# Altium project kont_lineP-C.PrjPcb
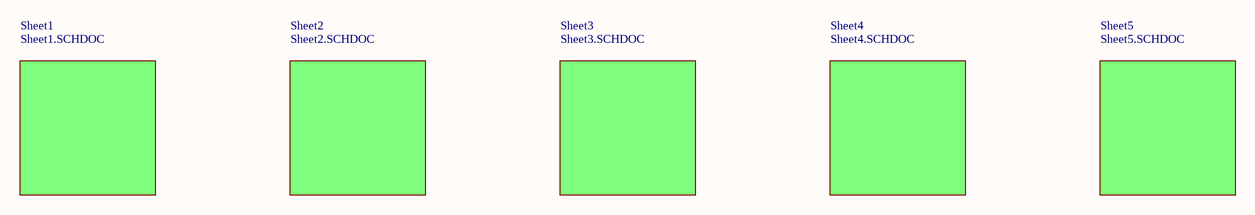
[diagram p0: First_Sheet.SCHDOC]
6 sheets, 211 parts. Net scope: global (net labels, ports and power ports of the same name join across sheets).
Sheets:
  First_Sheet.SCHDOC
    Sheet1 = Sheet1.SCHDOC
    Sheet2 = Sheet2.SCHDOC
    Sheet3 = Sheet3.SCHDOC
    Sheet4 = Sheet4.SCHDOC
    Sheet5 = Sheet5.SCHDOC

## Sheet First_Sheet.SCHDOC
size 840 x 594 mm

### Sub-sheets
Sheet1 = Sheet1.SCHDOC: no entries
Sheet2 = Sheet2.SCHDOC: no entries
Sheet3 = Sheet3.SCHDOC: no entries
Sheet4 = Sheet4.SCHDOC: no entries
Sheet5 = Sheet5.SCHDOC: no entries

## Sheet Sheet1.SCHDOC
size 840 x 594 mm; SheetNumber: 1; SheetTotal: 5; DocumentName: Sheet1.SCHDOC
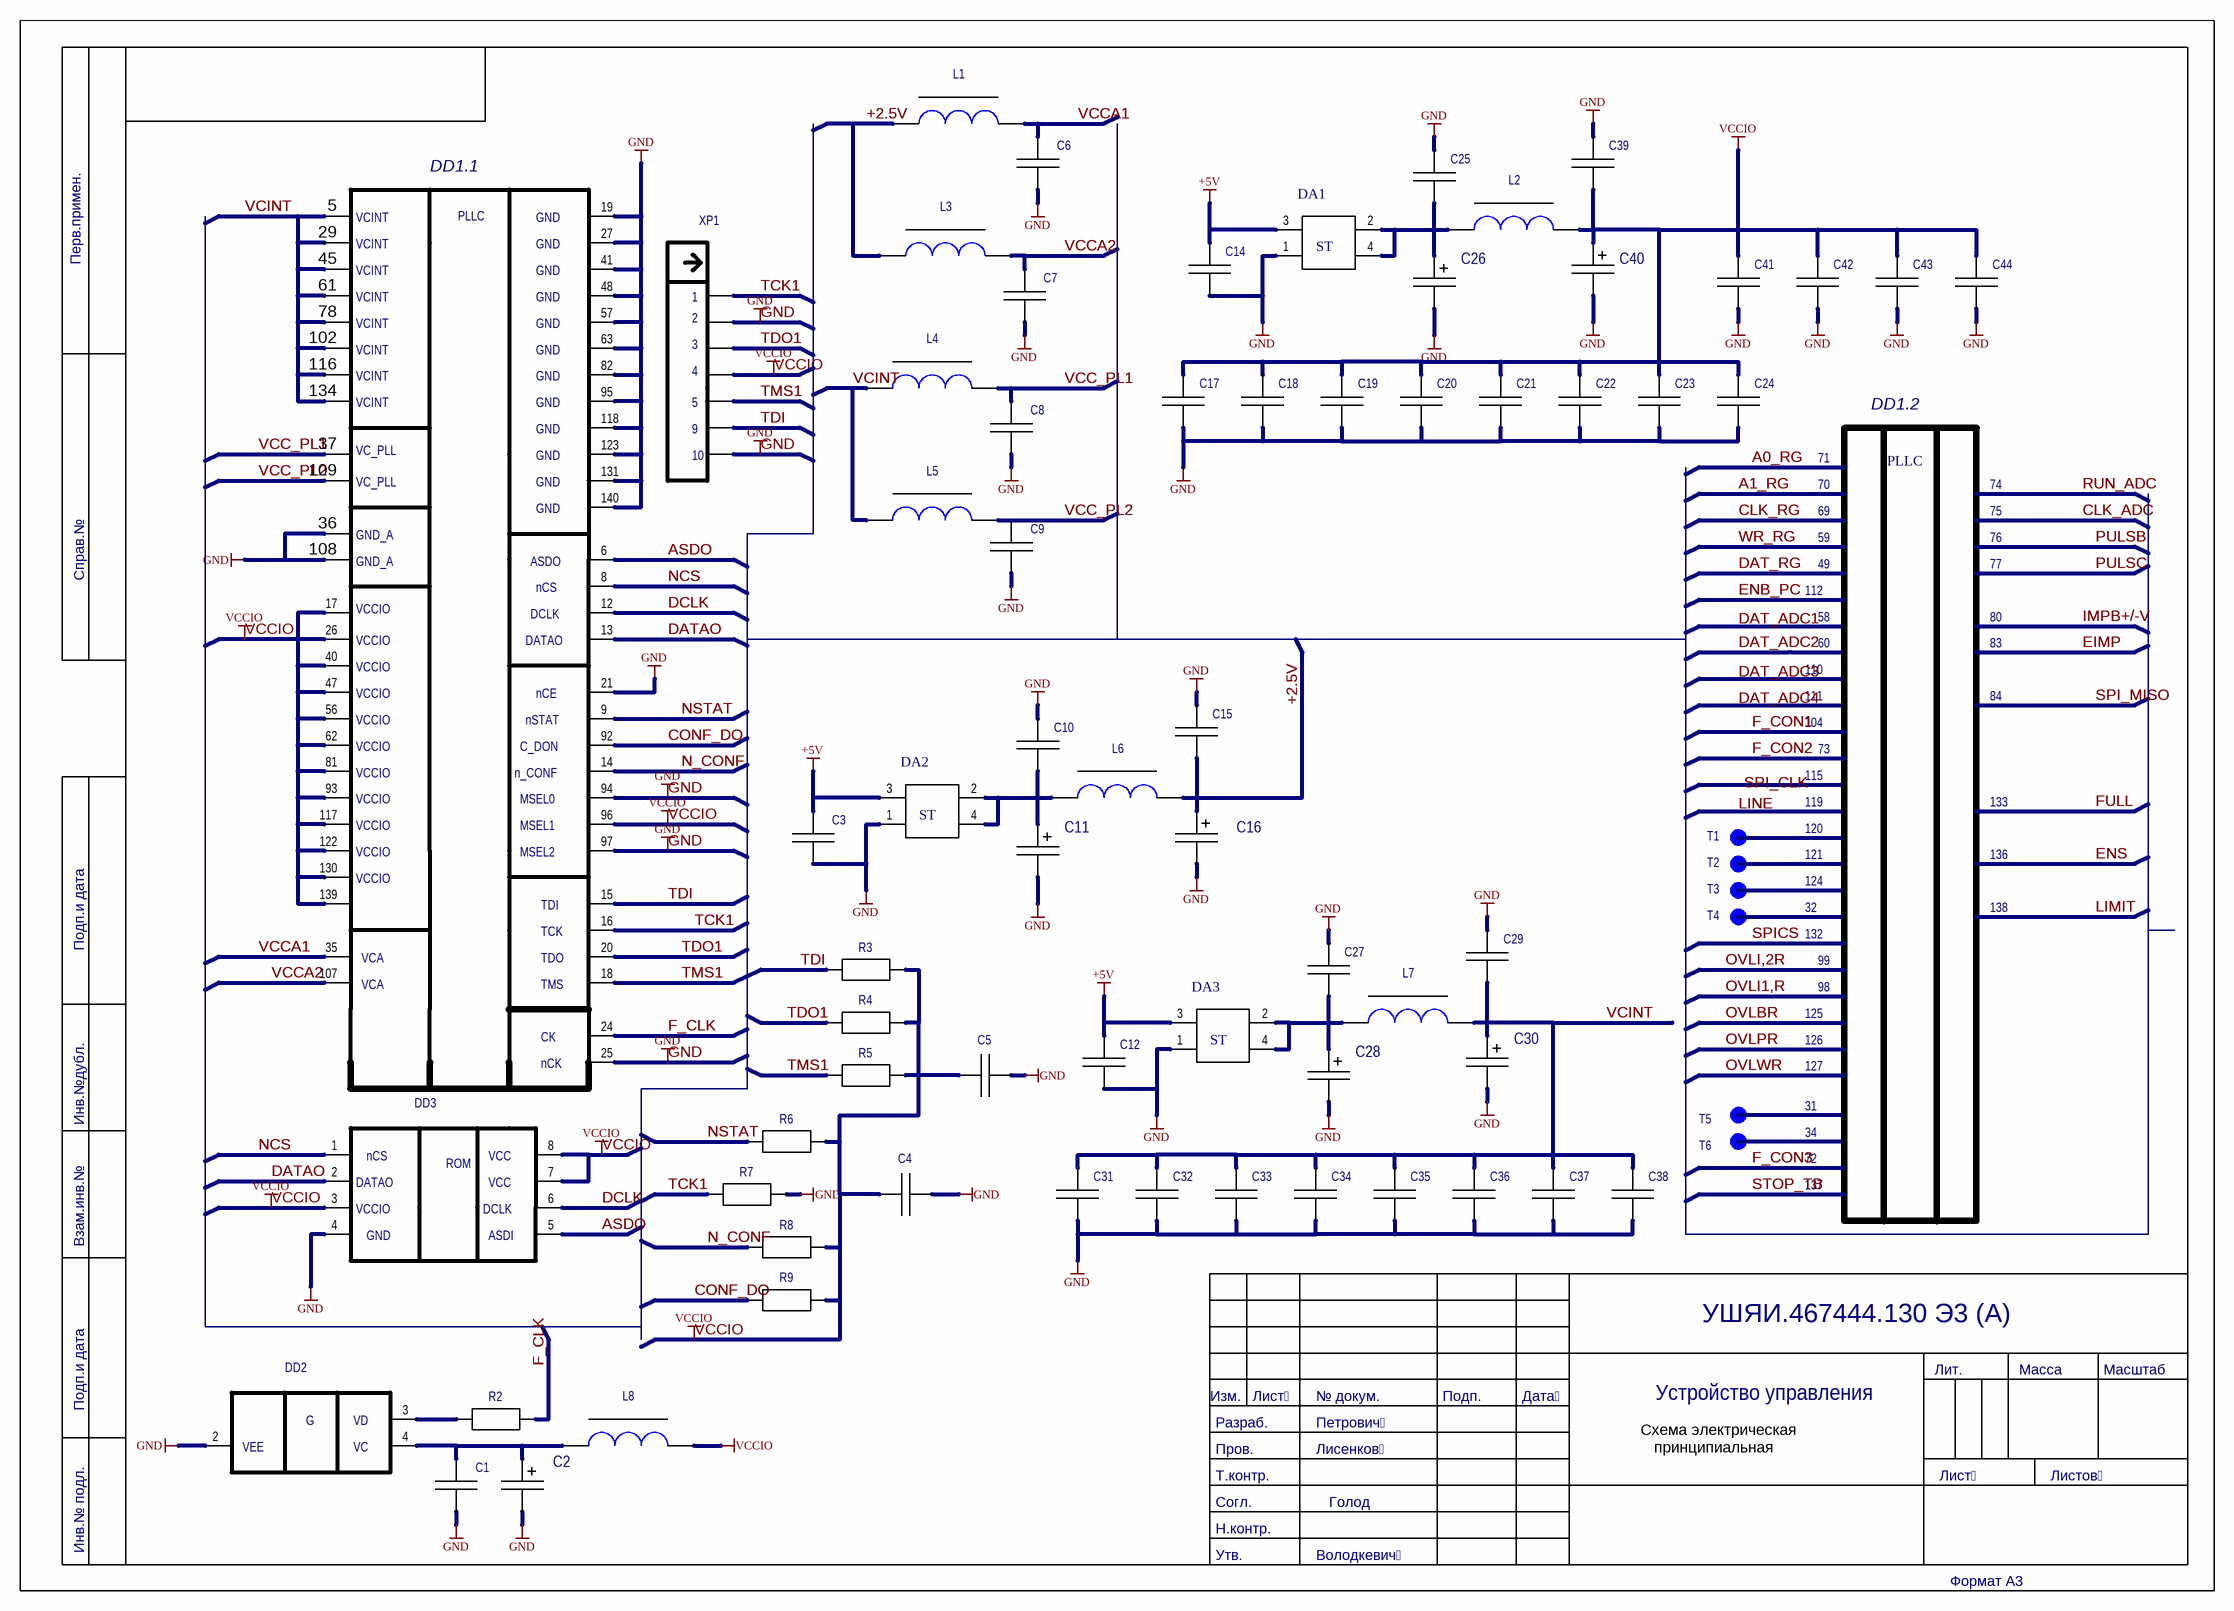
[diagram p1: Sheet1.SCHDOC]

### Parts
C1  GRM21BR71H104KA01L  (value not drawn)
C2  TAJB475K020  (value not drawn)
C3  GRM21BR71H104KA01L  (value not drawn)
C4  GRM21BR71H104KA01L  (value not drawn)
C5  GRM21BR71H104KA01L  (value not drawn)
C6  GRM21BR71H104KA01L  (value not drawn)
C7  GRM21BR71H104KA01L  (value not drawn)
C8  GRM21BR71H104KA01L  (value not drawn)
C9  GRM21BR71H104KA01L  (value not drawn)
C10  GRM21BR71H104KA01L  (value not drawn)
C11  TAJB475K020  (value not drawn)
C12  GRM21BR71H104KA01L  (value not drawn)
C14  GRM21BR71H104KA01L  (value not drawn)
C15  GRM21BR71H104KA01L  (value not drawn)
C16  TAJB106M016  (value not drawn)
C17  GRM21BR71H104KA01L  (value not drawn)
C18  GRM21BR71H104KA01L  (value not drawn)
C19  GRM21BR71H104KA01L  (value not drawn)
C20  GRM21BR71H104KA01L  (value not drawn)
C21  GRM21BR71H104KA01L  (value not drawn)
C22  GRM21BR71H104KA01L  (value not drawn)
C23  GRM21BR71H104KA01L  (value not drawn)
C24  GRM21BR71H104KA01L  (value not drawn)
C25  GRM21BR71H104KA01L  (value not drawn)
C26  TAJB475K020  (value not drawn)
C27  GRM21BR71H104KA01L  (value not drawn)
C28  TAJB475K020  (value not drawn)
C29  GRM21BR71H104KA01L  (value not drawn)
C30  TAJB106M016  (value not drawn)
C31  GRM21BR71H104KA01L  (value not drawn)
C32  GRM21BR71H104KA01L  (value not drawn)
C33  GRM21BR71H104KA01L  (value not drawn)
C34  GRM21BR71H104KA01L  (value not drawn)
C35  GRM21BR71H104KA01L  (value not drawn)
C36  GRM21BR71H104KA01L  (value not drawn)
C37  GRM21BR71H104KA01L  (value not drawn)
C38  GRM21BR71H104KA01L  (value not drawn)
C39  GRM21BR71H104KA01L  (value not drawn)
C40  TAJB106M016  (value not drawn)
C41  GRM21BR71H104KA01L  (value not drawn)
C42  GRM21BR71H104KA01L  (value not drawn)
C43  GRM21BR71H104KA01L  (value not drawn)
C44  GRM21BR71H104KA01L  (value not drawn)
DA1  LD1117AS33TR  (value not drawn)
DA2  LD1117AS25TR  (value not drawn)
DA3  LD1117AS12TR  (value not drawn)
DD1.1  EP3C5E144I7-G  (value not drawn)
DD2  J032  (value not drawn)
DD3  EPCS4SI8N  (value not drawn)
L1  LQH31CNR22M03  (value not drawn)
L2  ILBB0805ER601V  (value not drawn)
L3  LQH31CNR22M03  (value not drawn)
L4  LQH31CNR22M03  (value not drawn)
L5  LQH31CNR22M03  (value not drawn)
L6  ILBB0805ER601V  (value not drawn)
L7  ILBB0805ER601V  (value not drawn)
L8  ILBB0805ER601V  (value not drawn)
R2  0805-51 ОМ+-5%  [0805]  (value not drawn)
R3  0805-1 KОМ+-5%  [0805]  (value not drawn)
R4  0805-10 KОМ+-5%  [0805]  (value not drawn)
R5  0805-1 KОМ+-5%  [0805]  (value not drawn)
R6  0805-10 KОМ+-5%  [0805]  (value not drawn)
R7  0805-1 KОМ+-5%  [0805]  (value not drawn)
R8  0805-10 KОМ+-5%  [0805]  (value not drawn)
R9  0805-10 KОМ+-5%  [0805]  (value not drawn)
T1  ТОЧКА ПАЙКИ 1  [LEPESTOK7_750_224]  (value not drawn)
T13  ТОЧКА ПАЙКИ 1  [LEPESTOK7_750_224]  (value not drawn)
T14  ТОЧКА ПАЙКИ 1  [LEPESTOK7_750_224]  (value not drawn)
T15  ТОЧКА ПАЙКИ 1  [LEPESTOK7_750_224]  (value not drawn)
T20  ТОЧКА ПАЙКИ 1  [LEPESTOK7_750_224]  (value not drawn)
T21  ТОЧКА ПАЙКИ 1  [LEPESTOK7_750_224]  (value not drawn)
XP1  PLD-10  (value not drawn)

### Nets
+5V: C3.2 C12.2 C14.2 DA1.3 DA2.3 DA3.3
GND: C1.1 C2.2 C3.1 C4.2 C5.2 C6.1 C7.1 C8.1 C9.1 C10.2 C11.2 C12.1 C14.1 C15.2 C16.2 C17.1 C18.1 C19.1 C20.1 C21.1 C22.1 C23.1 C24.1 C25.2 C26.2 C27.2 C28.2 C29.2 C30.2 C31.1 C32.1 C33.1 C34.1 C35.1 C36.1 C37.1 C38.1 C39.2 C40.2 C41.1 C42.1 C43.1 C44.1 DA1.1 DA2.1 DA3.1 DD1.1.19 DD1.1.21 DD1.1.25 DD1.1.27 DD1.1.36 DD1.1.41 DD1.1.48 DD1.1.57 DD1.1.63 DD1.1.82 DD1.1.94 DD1.1.95 DD1.1.97 DD1.1.108 DD1.1.118 DD1.1.123 DD1.1.131 DD1.1.140 DD2.2 DD3.4 R7.2 XP1.2 XP1.10
VCCIO: C4.1 C5.1 C17.2 C18.2 C19.2 C20.2 C21.2 C22.2 C23.2 C24.2 C39.1 C40.1 C41.2 C42.2 C43.2 C44.2 DD1.1.17 DD1.1.26 DD1.1.40 DD1.1.47 DD1.1.56 DD1.1.62 DD1.1.81 DD1.1.93 DD1.1.96 DD1.1.117 DD1.1.122 DD1.1.130 DD1.1.139 DD3.3 DD3.7 DD3.8 L2.2 L8.2 R3.2 R4.2 R5.2 R6.2 R8.2 R9.2 XP1.4
+2.5V: C15.1 C16.1 L1.1 L3.1 L6.2
ASDO: DD1.1.6 DD3.5
CONF_DO: DD1.1.92 R9.1
DATAO: DD1.1.13 DD3.2
DCLK: DD1.1.12 DD3.6
F_CLK: DD1.1.24 R2.2
N_CONF: DD1.1.14 R8.1
NCS: DD1.1.8 DD3.1
NSTAT: DD1.1.9 R6.1
TCK1: DD1.1.16 R7.1 XP1.1
TDI: DD1.1.15 R3.1 XP1.9
TDO1: DD1.1.20 R4.1 XP1.3
TMS1: DD1.1.18 R5.1 XP1.5
VCC_PL1: C8.2 DD1.1.37 L4.2
VCC_PL2: C9.2 DD1.1.109 L5.2
VCCA1: C6.2 DD1.1.35 L1.2
VCCA2: C7.2 DD1.1.107 L3.2
VCINT: C29.1 C30.1 C31.2 C32.2 C33.2 C34.2 C35.2 C36.2 C37.2 C38.2 DD1.1.5 DD1.1.29 DD1.1.45 DD1.1.61 DD1.1.78 DD1.1.102 DD1.1.116 DD1.1.134 L4.1 L5.1 L7.2
NetC1_2: C1.2 C2.1 DD2.4 L8.1
NetC10_1: C10.1 C11.1
NetC25_1: C25.1 C26.1 DA1.2 DA1.4 L2.1
NetC27_1: C27.1 C28.1
NetDA2_2: DA2.2 DA2.4 L6.1
NetDA3_2: DA3.2 DA3.4 L7.1
NetDD2_3: DD2.3 R2.1

Not connected (* = marked no-connect by the designer): T1 1; T13 1; T14 1; T15 1; T20 1; T21 1

### Notes on the sheet
- (near DD1.1) DD1.1
- Перв.примен.
- DD1.2
- 70
- 71
- PLLC
- 74
- 69
- 49
- 59
- 75
- 76
- 77
- Справ.№
- 112
- 58
- 80
- 110
- 111
- 60
- 84
- 83
- 104
- 73
- 120
- 115
- 119
- 133
- T1
- T2
- T3
- 121
- 124
- 136
- Подп.и дата
- T4
- 32
- 132
- 99
- 138
- 125
- 98
- 126
- 127
- Инв.№дубл.
- T5
- T6
- 72
- 34
- 31
- Взам.инв.№
- 137
- УШЯИ.467444.130 Э3 (A)
- Лит.
- Масса
- Масштаб
- Изм.
- Разраб.
- Лист
- № докум.
- Петрович
- Подп.
- Дата
- Устройство управления
- Т.контр.
- Согл.
- Пров.
- Лисенков
- Голод
- Схема электрическая
  принципиальная
- Листов
- Инв.№ подл.
- Утв.
- Н.контр.
- Володкевич
- Формат А3
- Подп. дата
- Инв. № дубл.
- Взам. инв. №
- Подп. и дата
- Инв. № подл.
- Лист
- Дата
- ALTIUM GOSTBOM2.0 KEV
- Файл:
- Копировал
- (in symbol EP3C5E144I7-G) PLLC; VCINT; GND; VC_PLL; GND_A; ASDO; nCS; VCCIO; DCLK; DATAO; nCE; nSTAT; C_DON; n_CONF; MSEL0; MSEL1; MSEL2; TDI; TCK; VCA; TDO; TMS; CK; nCK
- (in symbol EPCS4SI8N) ROM; nCS; VCC; DATAO; VCCIO; DCLK; GND; ASDI
- (in symbol J032) G; VD; VEE; VC
- (in symbol LD1117AS12TR) ST
- (in symbol LD1117AS25TR) ST
- (in symbol LD1117AS33TR) ST

### Library data of the parts
C1 C3-C10 C12 C14 C15 C17-C25 C27 C29 C31-C39 C41-C44 = GRM21BR71H104KA01L: Name2: Конденсатор GRM21BR71H104KA01L; Value: *; Name1: Конденсатор GRM21BR71H104KA01L
C2 C11 C26 C28 = TAJB475K020: Standart: AVX; Name2: Конденсатор  TAJB475K020; Name1: Конденсатор TAJB475K020; Value: *
C16 C30 C40 = TAJB106M016: Standart: AVX; Name2: Конденсатор  TAJB106M016; Name1: Конденсатор TAJB106M016; Value: *
L1 L3-L5 = LQH31CNR22M03: Standart: MURATA; Name2: Дроссель LQH31CNR22M03; Name1: Дроссель LQH31CNR22M03
L2 L6-L8 = ILBB0805ER601V: Standart: MURATA; Name2: Дроссель ILBB0805ER601V; Name1: Дроссель ILBB0805ER601V
R2 = 0805-51 ОМ+-5%: Value: 51 Ом; Name1: Резистор 0805-51 Ом +-5%; Name2: Резистор 0805-51 Ом +-5%
R3 R5 R7 = 0805-1 KОМ+-5%: Value: 1 кОм; Name1: Резистор 0805-1 кОм+-5%; Name2: Резистор 0805-1 кОм+-5%
R4 R6 R8 R9 = 0805-10 KОМ+-5%: Name1: Резистор 0805-10 кОм+-5%; Name2: Резистор 0805-10 кОм+-5%
T1 T13-T15 T20 T21 = ТОЧКА ПАЙКИ 1: Name: Точка пайки; Value: *
DA1 = LD1117AS33TR: Value: *
DA2 = LD1117AS25TR: Value: *
DA3 = LD1117AS12TR: Value: *
DD1.1 = EP3C5E144I7-G: Value: *
DD2 = J032: Value: *
DD3 = EPCS4SI8N: Value: *
XP1 = PLD-10: Value: *

## Sheet Sheet2.SCHDOC
size 840 x 594 mm; SheetNumber: 2; SheetTotal: 5; DocumentName: Sheet2.SCHDOC
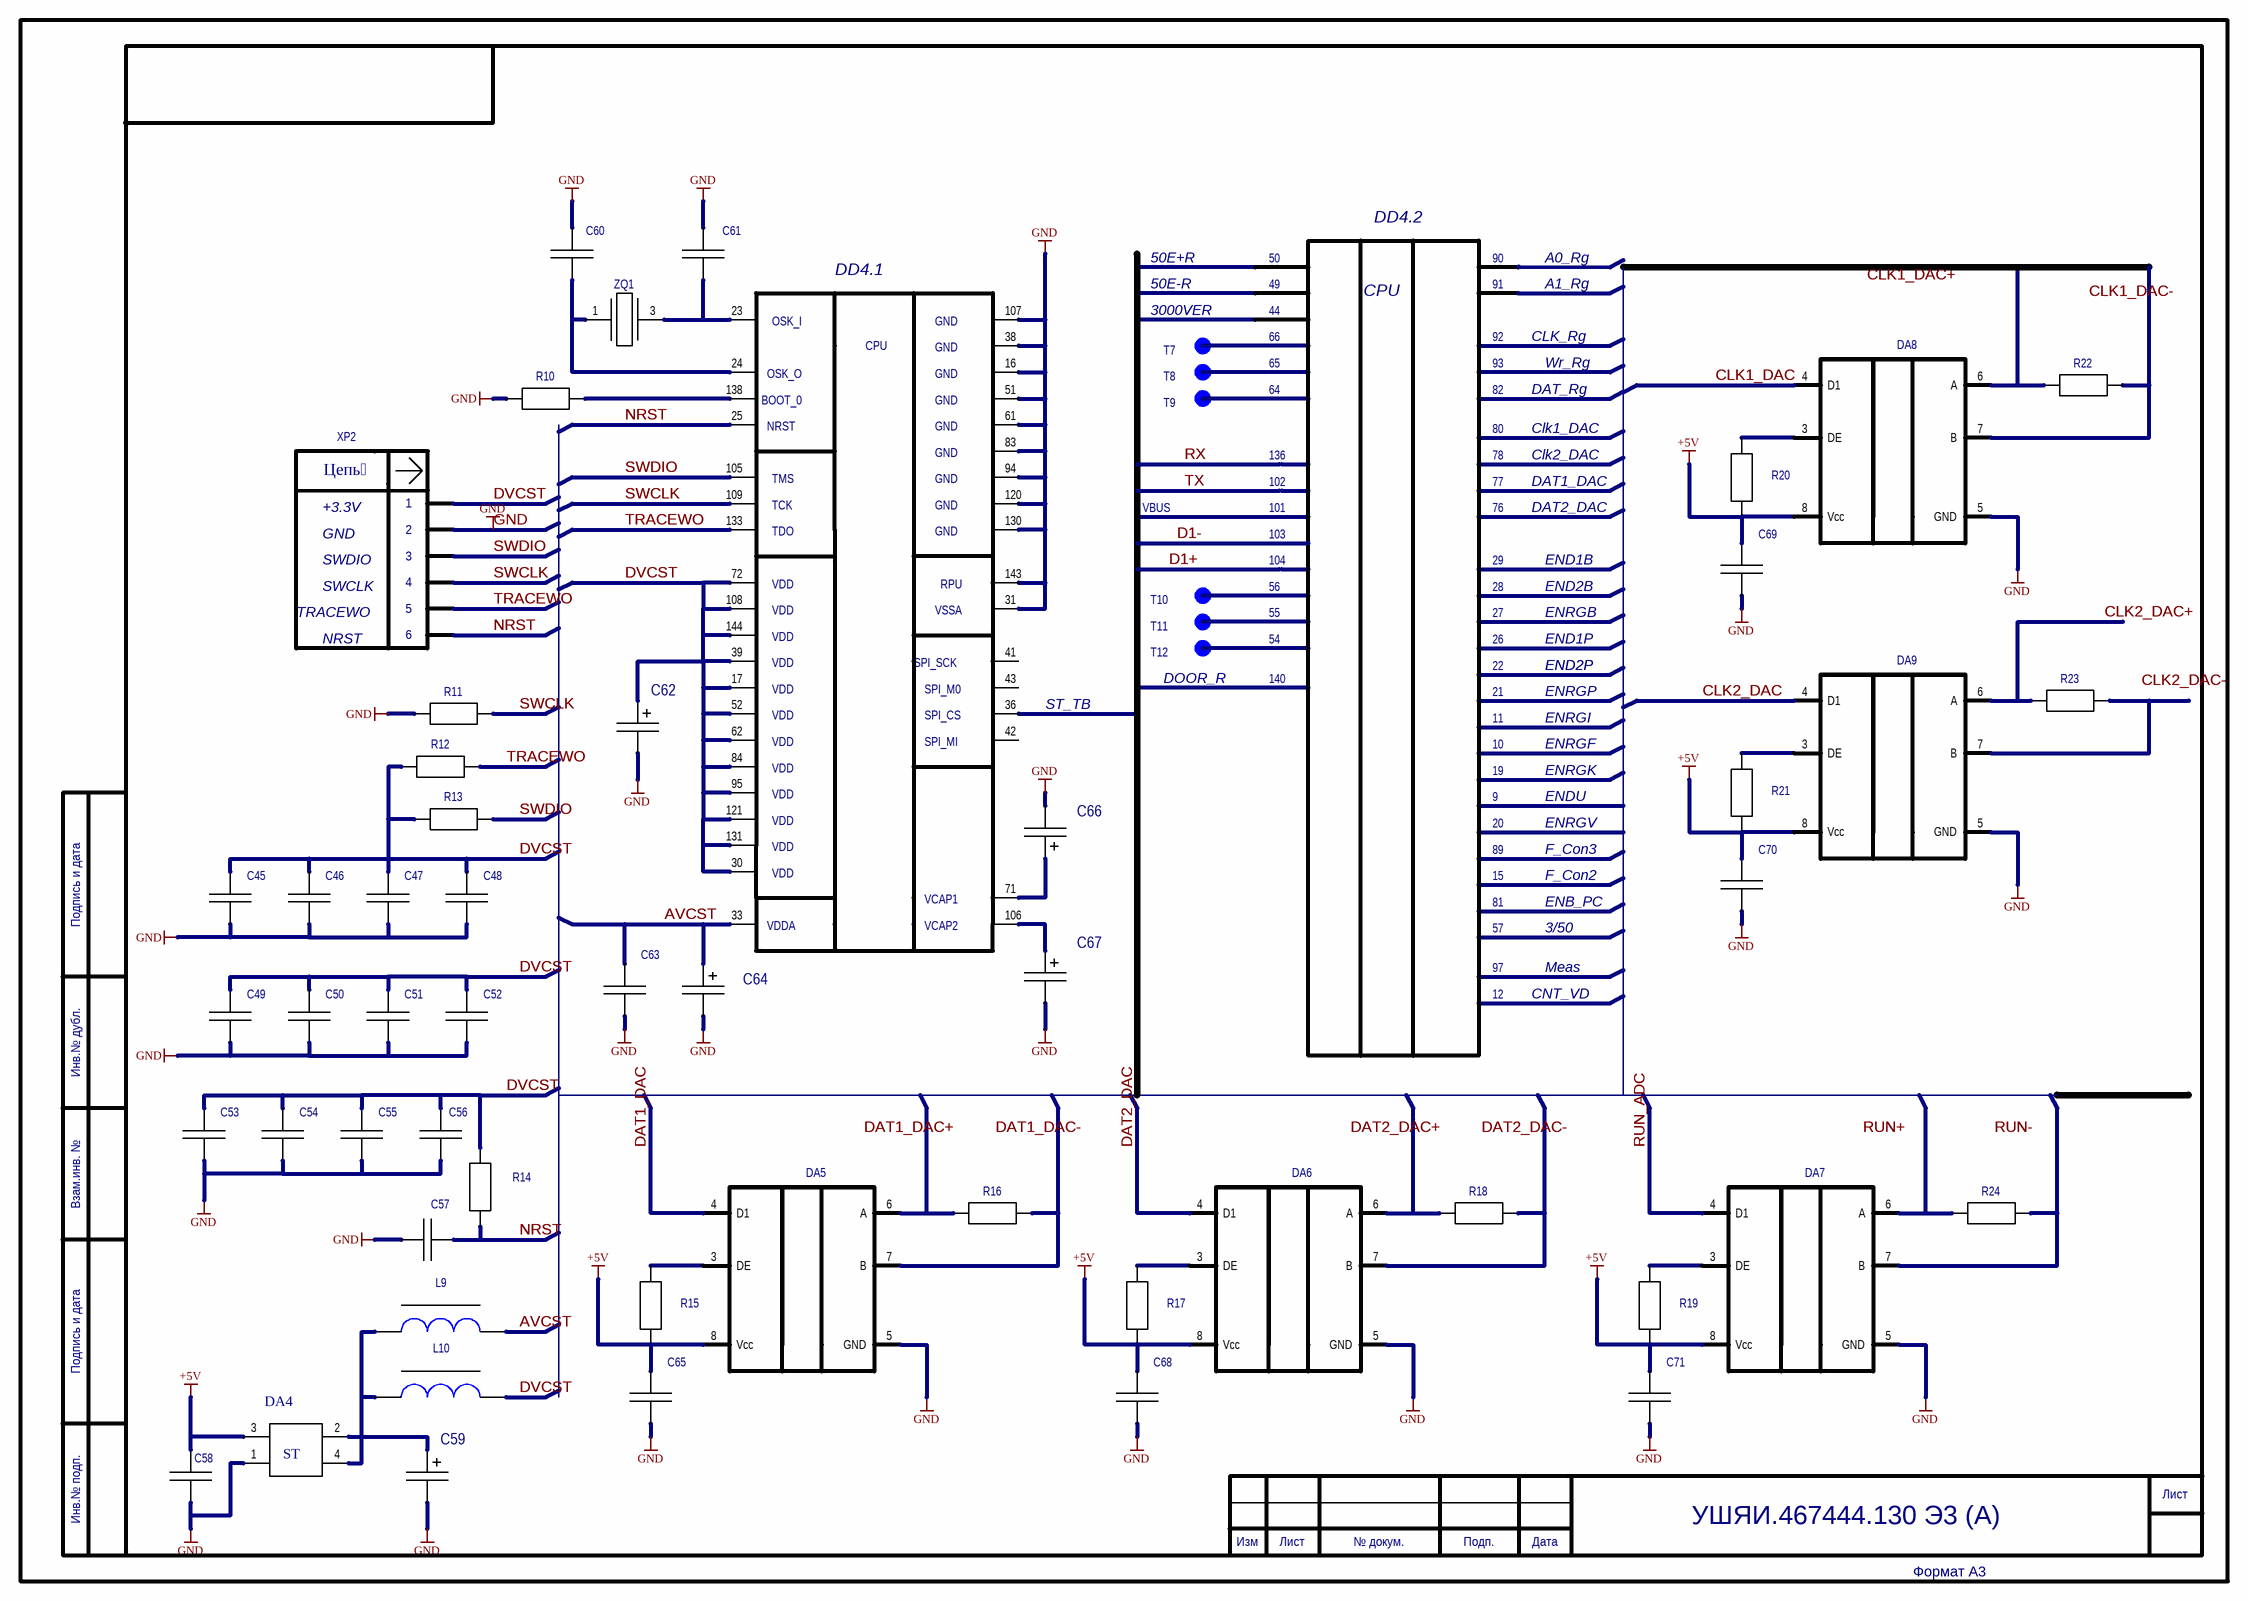
[diagram p2: Sheet2.SCHDOC]

### Parts
C45  GRM21BR71H104KA01L  (value not drawn)
C46  GRM21BR71H104KA01L  (value not drawn)
C47  GRM21BR71H104KA01L  (value not drawn)
C48  GRM21BR71H104KA01L  (value not drawn)
C49  GRM21BR71H104KA01L  (value not drawn)
C50  GRM21BR71H104KA01L  (value not drawn)
C51  GRM21BR71H104KA01L  (value not drawn)
C52  GRM21BR71H104KA01L  (value not drawn)
C53  GRM21BR71H104KA01L  (value not drawn)
C54  GRM21BR71H104KA01L  (value not drawn)
C55  GRM21BR71H104KA01L  (value not drawn)
C56  GRM21BR71H104KA01L  (value not drawn)
C57  GRM21BR71H104KA01L  (value not drawn)
C58  GRM21BR71H104KA01L  (value not drawn)
C59  TAJB475K020  (value not drawn)
C60  805-CG-20 ПФ  (value not drawn)
C61  805-CG-20 ПФ  (value not drawn)
C62  TAJB106M016  (value not drawn)
C63  GRM21BR71H104KA01L  (value not drawn)
C64  TAJB106M016  (value not drawn)
C65  GRM21BR71H104KA01L  (value not drawn)
C66  TAJA225M016  (value not drawn)
C67  TAJA225M016  (value not drawn)
C68  GRM21BR71H104KA01L  (value not drawn)
C69  GRM21BR71H104KA01L  (value not drawn)
C70  GRM21BR71H104KA01L  (value not drawn)
C71  GRM21BR71H104KA01L  (value not drawn)
DA4  LD1117AS33TR  (value not drawn)
DA5  ADM483  (value not drawn)
DA6  ADM483  (value not drawn)
DA7  ADM483  (value not drawn)
DA8  ADM483  (value not drawn)
DA9  ADM483  (value not drawn)
DD4.2  STM32F407ZGTX-A  (value not drawn)
L9  ILBB0805ER601V  (value not drawn)
L10  ILBB0805ER601V  (value not drawn)
R10  0805-10 KОМ+-5%  [0805]  (value not drawn)
R11  0805-10 KОМ+-5%  [0805]  (value not drawn)
R12  0805-10 KОМ+-5%  [0805]  (value not drawn)
R13  0805-10 KОМ+-5%  [0805]  (value not drawn)
R14  0805-10 KОМ+-5%  [0805]  (value not drawn)
R15  0805-10 KОМ+-5%  [0805]  (value not drawn)
R16  0805-10 KОМ+-5%  [0805]  (value not drawn)
R17  0805-10 KОМ+-5%  [0805]  (value not drawn)
R18  0805-10 KОМ+-5%  [0805]  (value not drawn)
R19  0805-10 KОМ+-5%  [0805]  (value not drawn)
R20  0805-10 KОМ+-5%  [0805]  (value not drawn)
R21  0805-10 KОМ+-5%  [0805]  (value not drawn)
R22  0805-10 KОМ+-5%  [0805]  (value not drawn)
R23  0805-10 KОМ+-5%  [0805]  (value not drawn)
R24  0805-10 KОМ+-5%  [0805]  (value not drawn)
T16  ТОЧКА ПАЙКИ 1  [LEPESTOK7_750_224]  (value not drawn)
T17  ТОЧКА ПАЙКИ 1  [LEPESTOK7_750_224]  (value not drawn)
T18  ТОЧКА ПАЙКИ 1  [LEPESTOK7_750_224]  (value not drawn)
T19  ТОЧКА ПАЙКИ 1  [LEPESTOK7_750_224]  (value not drawn)
T22  ТОЧКА ПАЙКИ 1  [LEPESTOK7_750_224]  (value not drawn)
T23  ТОЧКА ПАЙКИ 1  [LEPESTOK7_750_224]  (value not drawn)
XP2  AMP II 280372-2  (value not drawn)
ZQ1  QUARZ JXS63  [JXS63]  (value not drawn)

### Nets
+5V: C58.2 C65.2 C68.2 C69.2 C70.2 C71.2 DA4.3 DA5.8(Vcc) DA6.8(Vcc) DA7.8(Vcc) DA8.8(Vcc) DA9.8(Vcc) R15.1 R17.1 R19.1 R20.1 R21.1
GND: C45.1 C46.1 C47.1 C48.1 C49.1 C50.1 C51.1 C52.1 C53.1 C54.1 C55.1 C56.1 C57.2 C58.1 C59.2 C60.2 C61.2 C62.2 C63.1 C64.2 C65.1 C66.2 C67.2 C68.1 C69.1 C70.1 C71.1 DA4.1 DA5.5(GND) DA6.5(GND) DA7.5(GND) DA8.5(GND) DA9.5(GND) DD4.2.16 DD4.2.31 DD4.2.38 DD4.2.51 DD4.2.61 DD4.2.83 DD4.2.94 DD4.2.107 DD4.2.120 DD4.2.130 DD4.2.143 R10.1 R11.1 XP2.2
AVCST: C63.2 C64.1 DD4.2.33 L9.2
CLK1_DAC: DA8.4(D1)
CLK2_DAC: DA9.4(D1)
CLK2_DAC+: DA9.6(A) R23.1
DAT1_DAC: DA5.4(D1)
DAT2_DAC: DA6.4(D1)
DVCST: C45.2 C46.2 C47.2 C48.2 C49.2 C50.2 C51.2 C52.2 C53.2 C54.2 C55.2 C56.2 C62.1 DD4.2.17 DD4.2.30 DD4.2.39 DD4.2.52 DD4.2.62 DD4.2.72 DD4.2.84 DD4.2.95 DD4.2.108 DD4.2.121 DD4.2.131 DD4.2.144 L10.2 R12.1 R13.1 R14.2 XP2.1
NRST: C57.1 DD4.2.25 R14.1 XP2.6
RUN_ADC: DA7.4(D1)
SWCLK: DD4.2.109 R11.2 XP2.4
SWDIO: DD4.2.105 R13.2 XP2.3
TRACEWO: DD4.2.133 R12.2 XP2.5
NetC59_1: C59.1 DA4.2 DA4.4 L9.1 L10.1
NetC60_1: C60.1 DD4.2.24 ZQ1.1
NetC61_1: C61.1 DD4.2.23 ZQ1.3
NetC66_1: C66.1 DD4.2.71
NetC67_1: C67.1 DD4.2.106
NetDA5_3: DA5.3(DE) R15.2
NetDA5_6: DA5.6(A) R16.1
NetDA5_7: DA5.7(B) R16.2
NetDA6_3: DA6.3(DE) R17.2
NetDA6_6: DA6.6(A) R18.1
NetDA6_7: DA6.7(B) R18.2
NetDA7_3: DA7.3(DE) R19.2
NetDA7_6: DA7.6(A) R24.1
NetDA7_7: DA7.7(B) R24.2
NetDA8_3: DA8.3(DE) R20.2
NetDA8_6: DA8.6(A) R22.1
NetDA8_7: DA8.7(B) R22.2
NetDA9_3: DA9.3(DE) R21.2
NetDA9_7: DA9.7(B) R23.2
NetDD4.2_138: DD4.2.138 R10.2

Not connected (* = marked no-connect by the designer): DD4.2 36 41 42 43; T16 1; T17 1; T18 1; T19 1; T22 1; T23 1; ZQ1 2 4

### Notes on the sheet
- DD4.2
- (near DD4.2) DD4.1
- 50E-R
- 50E+R
- 49
- 50
- 90
- 91
- A1_Rg
- A0_Rg
- (near T16) 3000VER
- T7
- 44
- 66
- CPU
- 92
- CLK_Rg
- T9
- T8
- 64
- 65
- 82
- 93
- DAT_Rg
- Wr_Rg
- 102
- 136
- 77
- 80
- 78
- DAT1_DAC
- Clk1_DAC
- Clk2_DAC
- +3.3V
- GND
- VBUS
- 101
- 103
- 76
- DAT2_DAC
- TRACEWO
- SWDIO
- SWCLK
- T10
- 104
- 56
- 55
- 29
- 28
- 27
- END1B
- END2B
- ENRGB
- NRST
- T12
- T11
- (near T23) DOOR_R
- 140
- 54
- 26
- 22
- 21
- END1P
- END2P
- ENRGP
- (near DD4.2) ST_TB
- 11
- 10
- ENRGI
- ENRGF
- 9
- 20
- 19
- ENDU
- ENRGV
- ENRGK
- Подпись и дата
- 15
- 89
- F_Con2
- F_Con3
- 81
- 57
- 3/50
- ENB_PC
- 12
- 97
- CNT_VD
- Meas
- Инв.№ дубл.
- Взам.инв. №
- Инв.№ подп.
- Лист
- Изм
- № докум.
- Подп.
- Дата
- УШЯИ.467444.130 Э3 (A)
- Формат А3
- Подп. дата
- Инв. № дубл.
- Взам. инв. №
- Подп. и дата
- Инв. № подл.
- Изм.
- ALTIUM GOSTBOM2.0 KEV
- Файл:
- Копировал
- (in symbol AMP II 280372-2) Цепь
- (in symbol LD1117AS33TR) ST
- (in symbol STM32F407ZGTX-A) OSK_I; GND; CPU; OSK_O; BOOT_0; NRST; TMS; TCK; TDO; VDD; RPU; VSSA; SPI_SCK; SPI_M0; SPI_CS; SPI_MI; VCAP1; VDDA; VCAP2

### Library data of the parts
C45-C58 C63 C65 C68-C71 = GRM21BR71H104KA01L: Name2: Конденсатор GRM21BR71H104KA01L; Value: *; Name1: Конденсатор GRM21BR71H104KA01L
C59 = TAJB475K020: as C2 on sheet Sheet1; Value: *
C60 C61 = 805-CG-20 ПФ: Name2: Конденсатор 805-CG-20 пФ; Name1: Конденсатор 805-CG-20 пФ
C62 C64 = TAJB106M016: as C16 on sheet Sheet1; Value: *
C66 C67 = TAJA225M016: Standart: AVX; Name2: Конденсатор  TAJA225M016; Name1: Конденсатор TAJA225M016; Value: *
DA5-DA9 = ADM483: Standart: Analog Devices; Name2: ADM483AR; Value: *; Name1: ADM483AR
L9 L10 = ILBB0805ER601V: as L2 on sheet Sheet1; Name1: Дроссель ILBB0805ER601V
R10-R24 = 0805-10 KОМ+-5%: Name1: Резистор 0805-10 кОм+-5%; Name2: Резистор 0805-10 кОм+-5%
T16-T19 T22 T23 = ТОЧКА ПАЙКИ 1: Name: Точка пайки; Value: *
XP2 = AMP II 280372-2: Name2: Вилка AMPMODU II-280379-2 Tyco Electronics; Name1: Вилка AMPMODU II-280379-2  Tyco Electronics; Standart: ELFA (43-836-26); Value: *
ZQ1 = QUARZ JXS63: Standart: Jauch; Name1: Резонатор Q 25.0JXS63-12-30/30-FU Jauch; Name2: Резонатор Q 25.0JXS63-12-30/30-FU; Value: *
DA4 = LD1117AS33TR: Value: *
DD4.2 = STM32F407ZGTX-A: Value: *

## Sheet Sheet3.SCHDOC
size 840 x 594 mm; SheetNumber: 3; SheetTotal: 5; DocumentName: Sheet3.SCHDOC
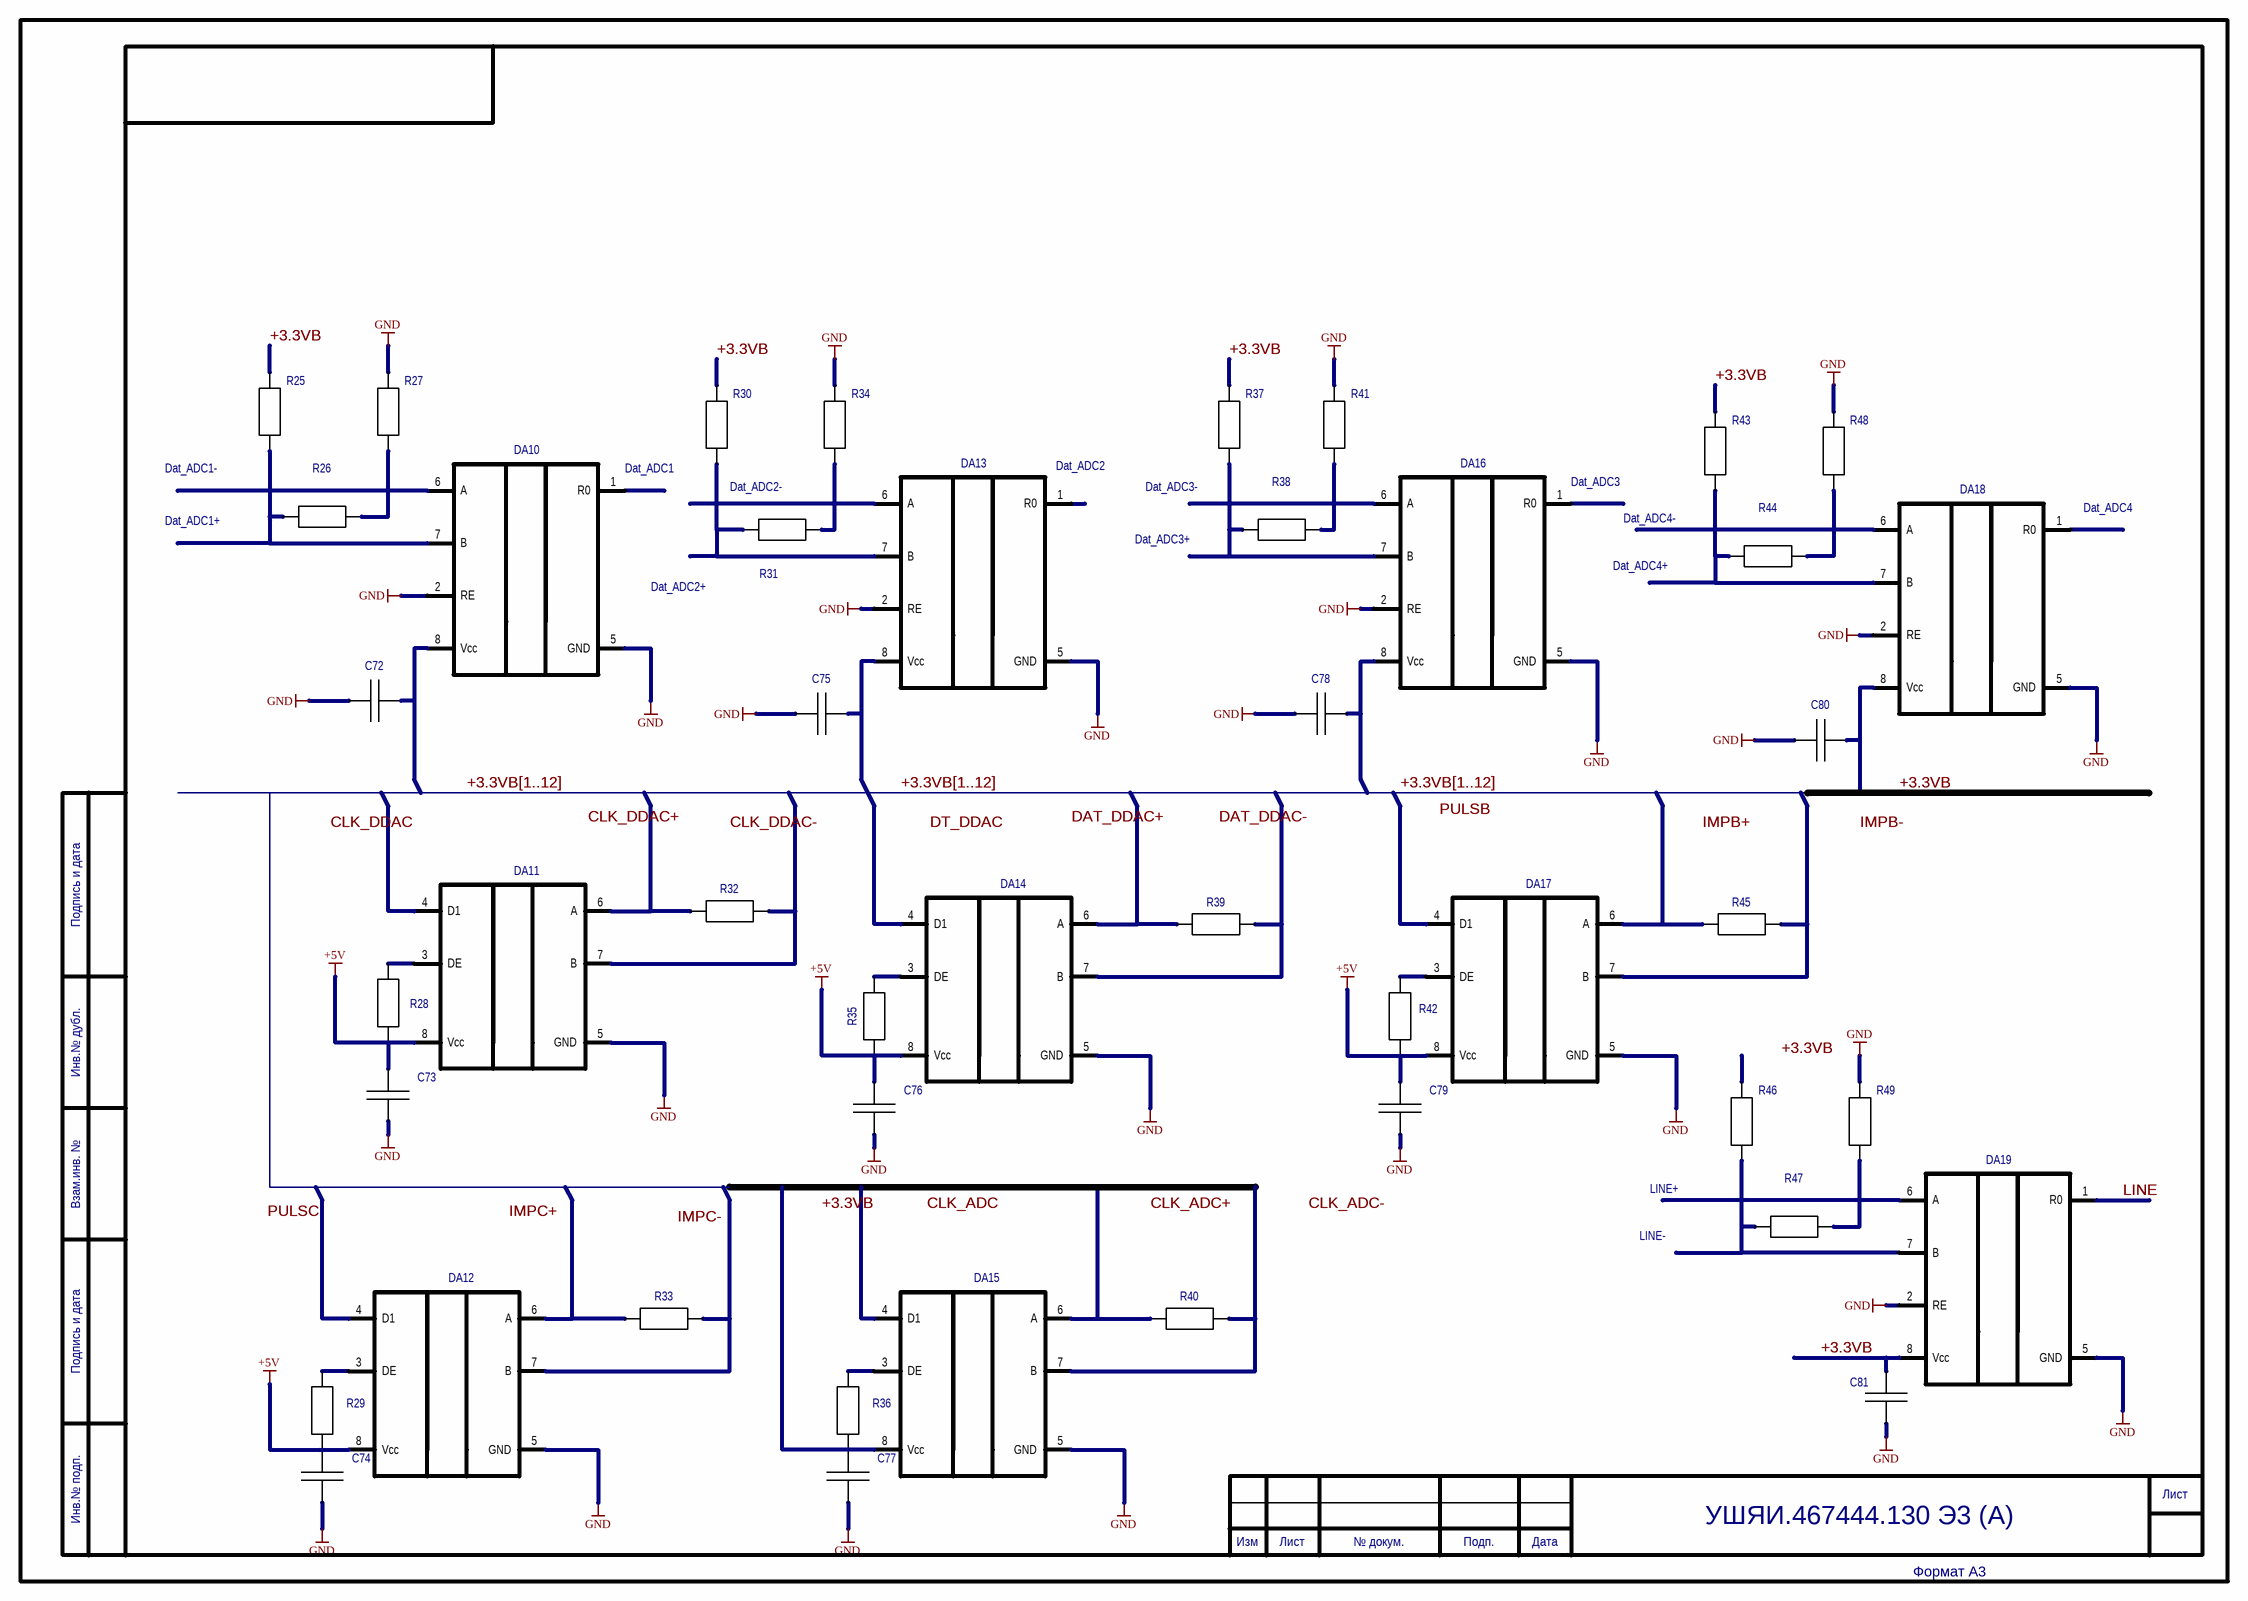
[diagram p3: Sheet3.SCHDOC]

### Parts
C72  GRM21BR71H105K  (value not drawn)
C73  GRM21BR71H104KA01L  (value not drawn)
C74  GRM21BR71H104KA01L  (value not drawn)
C75  GRM21BR71H105K  (value not drawn)
C76  GRM21BR71H104KA01L  (value not drawn)
C77  GRM21BR71H104KA01L  (value not drawn)
C78  GRM21BR71H105K  (value not drawn)
C79  GRM21BR71H104KA01L  (value not drawn)
C80  GRM21BR71H105K  (value not drawn)
C81  GRM21BR71H105K  (value not drawn)
DA10  SN65HVD75  (value not drawn)
DA11  ADM483  (value not drawn)
DA12  ADM483  (value not drawn)
DA13  SN65HVD75  (value not drawn)
DA14  ADM483  (value not drawn)
DA15  SN65HVD75-A  (value not drawn)
DA16  SN65HVD75  (value not drawn)
DA17  ADM483  (value not drawn)
DA18  SN65HVD75  (value not drawn)
DA19  SN65HVD75  (value not drawn)
R25  1206-1 КОМ+-5%  (value not drawn)
R26  1206 - 100 ОМ+-5%  (value not drawn)
R27  1206-1 КОМ+-5%  (value not drawn)
R28  0805-10 KОМ+-5%  [0805]  (value not drawn)
R29  0805-10 KОМ+-5%  [0805]  (value not drawn)
R30  1206-1 КОМ+-5%  (value not drawn)
R31  1206 - 100 ОМ+-5%  (value not drawn)
R32  0805-10 KОМ+-5%  [0805]  (value not drawn)
R33  0805-10 KОМ+-5%  [0805]  (value not drawn)
R34  1206-1 КОМ+-5%  (value not drawn)
R35  0805-10 KОМ+-5%  [0805]  (value not drawn)
R36  0805-10 KОМ+-5%  [0805]  (value not drawn)
R37  1206-1 КОМ+-5%  (value not drawn)
R38  1206 - 100 ОМ+-5%  (value not drawn)
R39  0805-10 KОМ+-5%  [0805]  (value not drawn)
R40  0805-10 KОМ+-5%  [0805]  (value not drawn)
R41  1206-1 КОМ+-5%  (value not drawn)
R42  0805-10 KОМ+-5%  [0805]  (value not drawn)
R43  1206-1 КОМ+-5%  (value not drawn)
R44  1206 - 100 ОМ+-5%  (value not drawn)
R45  0805-10 KОМ+-5%  [0805]  (value not drawn)
R46  1206-1 КОМ+-5%  (value not drawn)
R47  1206 - 100 ОМ+-5%  (value not drawn)
R48  1206-1 КОМ+-5%  (value not drawn)
R49  1206-1 КОМ+-5%  (value not drawn)

### Nets
+5V: C73.2 C74.2 C76.2 C79.2 DA11.8(Vcc) DA12.8(Vcc) DA14.8(Vcc) DA17.8(Vcc) R28.1 R29.1 R35.1 R42.1
GND: C72.1 C73.1 C74.1 C75.1 C76.1 C77.1 C78.1 C79.1 C80.1 C81.1 DA10.2(RE) DA10.5(GND) DA11.5(GND) DA12.5(GND) DA13.2(RE) DA13.5(GND) DA14.5(GND) DA15.5(GND) DA16.2(RE) DA16.5(GND) DA17.5(GND) DA18.2(RE) DA18.5(GND) DA19.2(RE) DA19.5(GND) R27.2 R34.2 R41.2 R48.2 R49.2
+3.3VB: C81.2 DA19.8(Vcc) R25.2 R30.2 R37.2 R43.2
LINE: DA19.1(R0)
NetC72_2: C72.2 DA10.8(Vcc)
NetC75_2: C75.2 DA13.8(Vcc)
NetC77_2: C77.2 DA15.8(Vcc) R36.1
NetC78_2: C78.2 DA16.8(Vcc)
NetC80_2: C80.2 DA18.8(Vcc)
NetDA10_6: DA10.6(A) R26.2 R27.1
NetDA10_7: DA10.7(B) R25.1 R26.1
NetDA11_3: DA11.3(DE) R28.2
NetDA11_6: DA11.6(A) R32.1
NetDA11_7: DA11.7(B) R32.2
NetDA12_3: DA12.3(DE) R29.2
NetDA12_6: DA12.6(A) R33.1
NetDA12_7: DA12.7(B) R33.2
NetDA13_6: DA13.6(A) R31.2 R34.1
NetDA13_7: DA13.7(B) R30.1 R31.1
NetDA14_3: DA14.3(DE) R35.2
NetDA14_6: DA14.6(A) R39.1
NetDA14_7: DA14.7(B) R39.2
NetDA15_3: DA15.3(DE) R36.2
NetDA15_6: DA15.6(A) R40.1
NetDA15_7: DA15.7(B) R40.2
NetDA16_6: DA16.6(A) R38.2 R41.1
NetDA16_7: DA16.7(B) R37.1 R38.1
NetDA17_3: DA17.3(DE) R42.2
NetDA17_6: DA17.6(A) R45.1
NetDA17_7: DA17.7(B) R45.2
NetDA18_6: DA18.6(A) R44.2 R48.1
NetDA18_7: DA18.7(B) R43.1 R44.1
NetDA19_6: DA19.6(A) R47.2 R49.1
NetDA19_7: DA19.7(B) R46.1 R47.1

Not connected (* = marked no-connect by the designer): DA10 1(R0); DA11 4(D1); DA12 4(D1); DA13 1(R0); DA14 4(D1); DA15 4(D1); DA16 1(R0); DA17 4(D1); DA18 1(R0); R46 2

### Buses and harness runs
bus +3.3VB[1..12]

### Notes on the sheet
- (near R25) Dat_ADC1-
- Dat_ADC1
- Dat_ADC2-
- (near DA13) Dat_ADC2
- Dat_ADC3-
- (near DA16) Dat_ADC3
- (near DA18) Dat_ADC4
- Dat_ADC1+
- Dat_ADC3+
- Dat_ADC4+
- Dat_ADC4-
- Dat_ADC2+
- Подпись и дата
- Инв.№ дубл.
- Взам.инв. №
- LINE-
- LINE+
- Инв.№ подп.
- УШЯИ.467444.130 Э3 (A)
- Лист
- Изм
- № докум.
- Подп.
- Дата
- Формат А3
- Подп. дата
- Инв. № дубл.
- Взам. инв. №
- Подп. и дата
- Инв. № подл.
- Изм.
- ALTIUM GOSTBOM2.0 KEV
- Файл:
- Копировал

### Library data of the parts
C72 C75 C78 C80 C81 = GRM21BR71H105K: Name2: Конденсатор GRM21BR71H105K; Name1: Конденсатор GRM21BR71H105K Murata; Value: *
C73 C74 C76 C77 C79 = GRM21BR71H104KA01L: Name2: Конденсатор GRM21BR71H104KA01L; Value: *; Name1: Конденсатор GRM21BR71H104KA01L
DA10 DA13 DA16 DA18 DA19 = SN65HVD75: Standart: Analog Devices; Name2: ADM483AR; Value: *; Name1: ADM483AR
DA11 DA12 DA14 DA17 = ADM483: as DA5 on sheet Sheet2; Value: *; Name1: ADM483AR
DA15 = SN65HVD75-A: Name1: ADM483AR; Standart: Analog Devices; Value: *; Name2: ADM483AR
R25 R27 R30 R34 R37 R41 R43 R46 R48 R49 = 1206-1 КОМ+-5%: Name1: Резистор 1206-1 кОм+-5%; Value: *; Name2: Резистор 1206-1 кОм+-5%
R26 R31 R38 R44 R47 = 1206 - 100 ОМ+-5%: Name2: Резистор 1206 - 100 Ом+-5%; Value: *; Name1: Резистор 1206 - 100 Ом+-5%
R28 R29 R32 R33 R35 R36 R39 R40 R42 R45 = 0805-10 KОМ+-5%: Name1: Резистор 0805-10 кОм+-5%; Name2: Резистор 0805-10 кОм+-5%

## Sheet Sheet4.SCHDOC
size 840 x 594 mm; SheetNumber: 4; SheetTotal: 5; DocumentName: Sheet4.SCHDOC
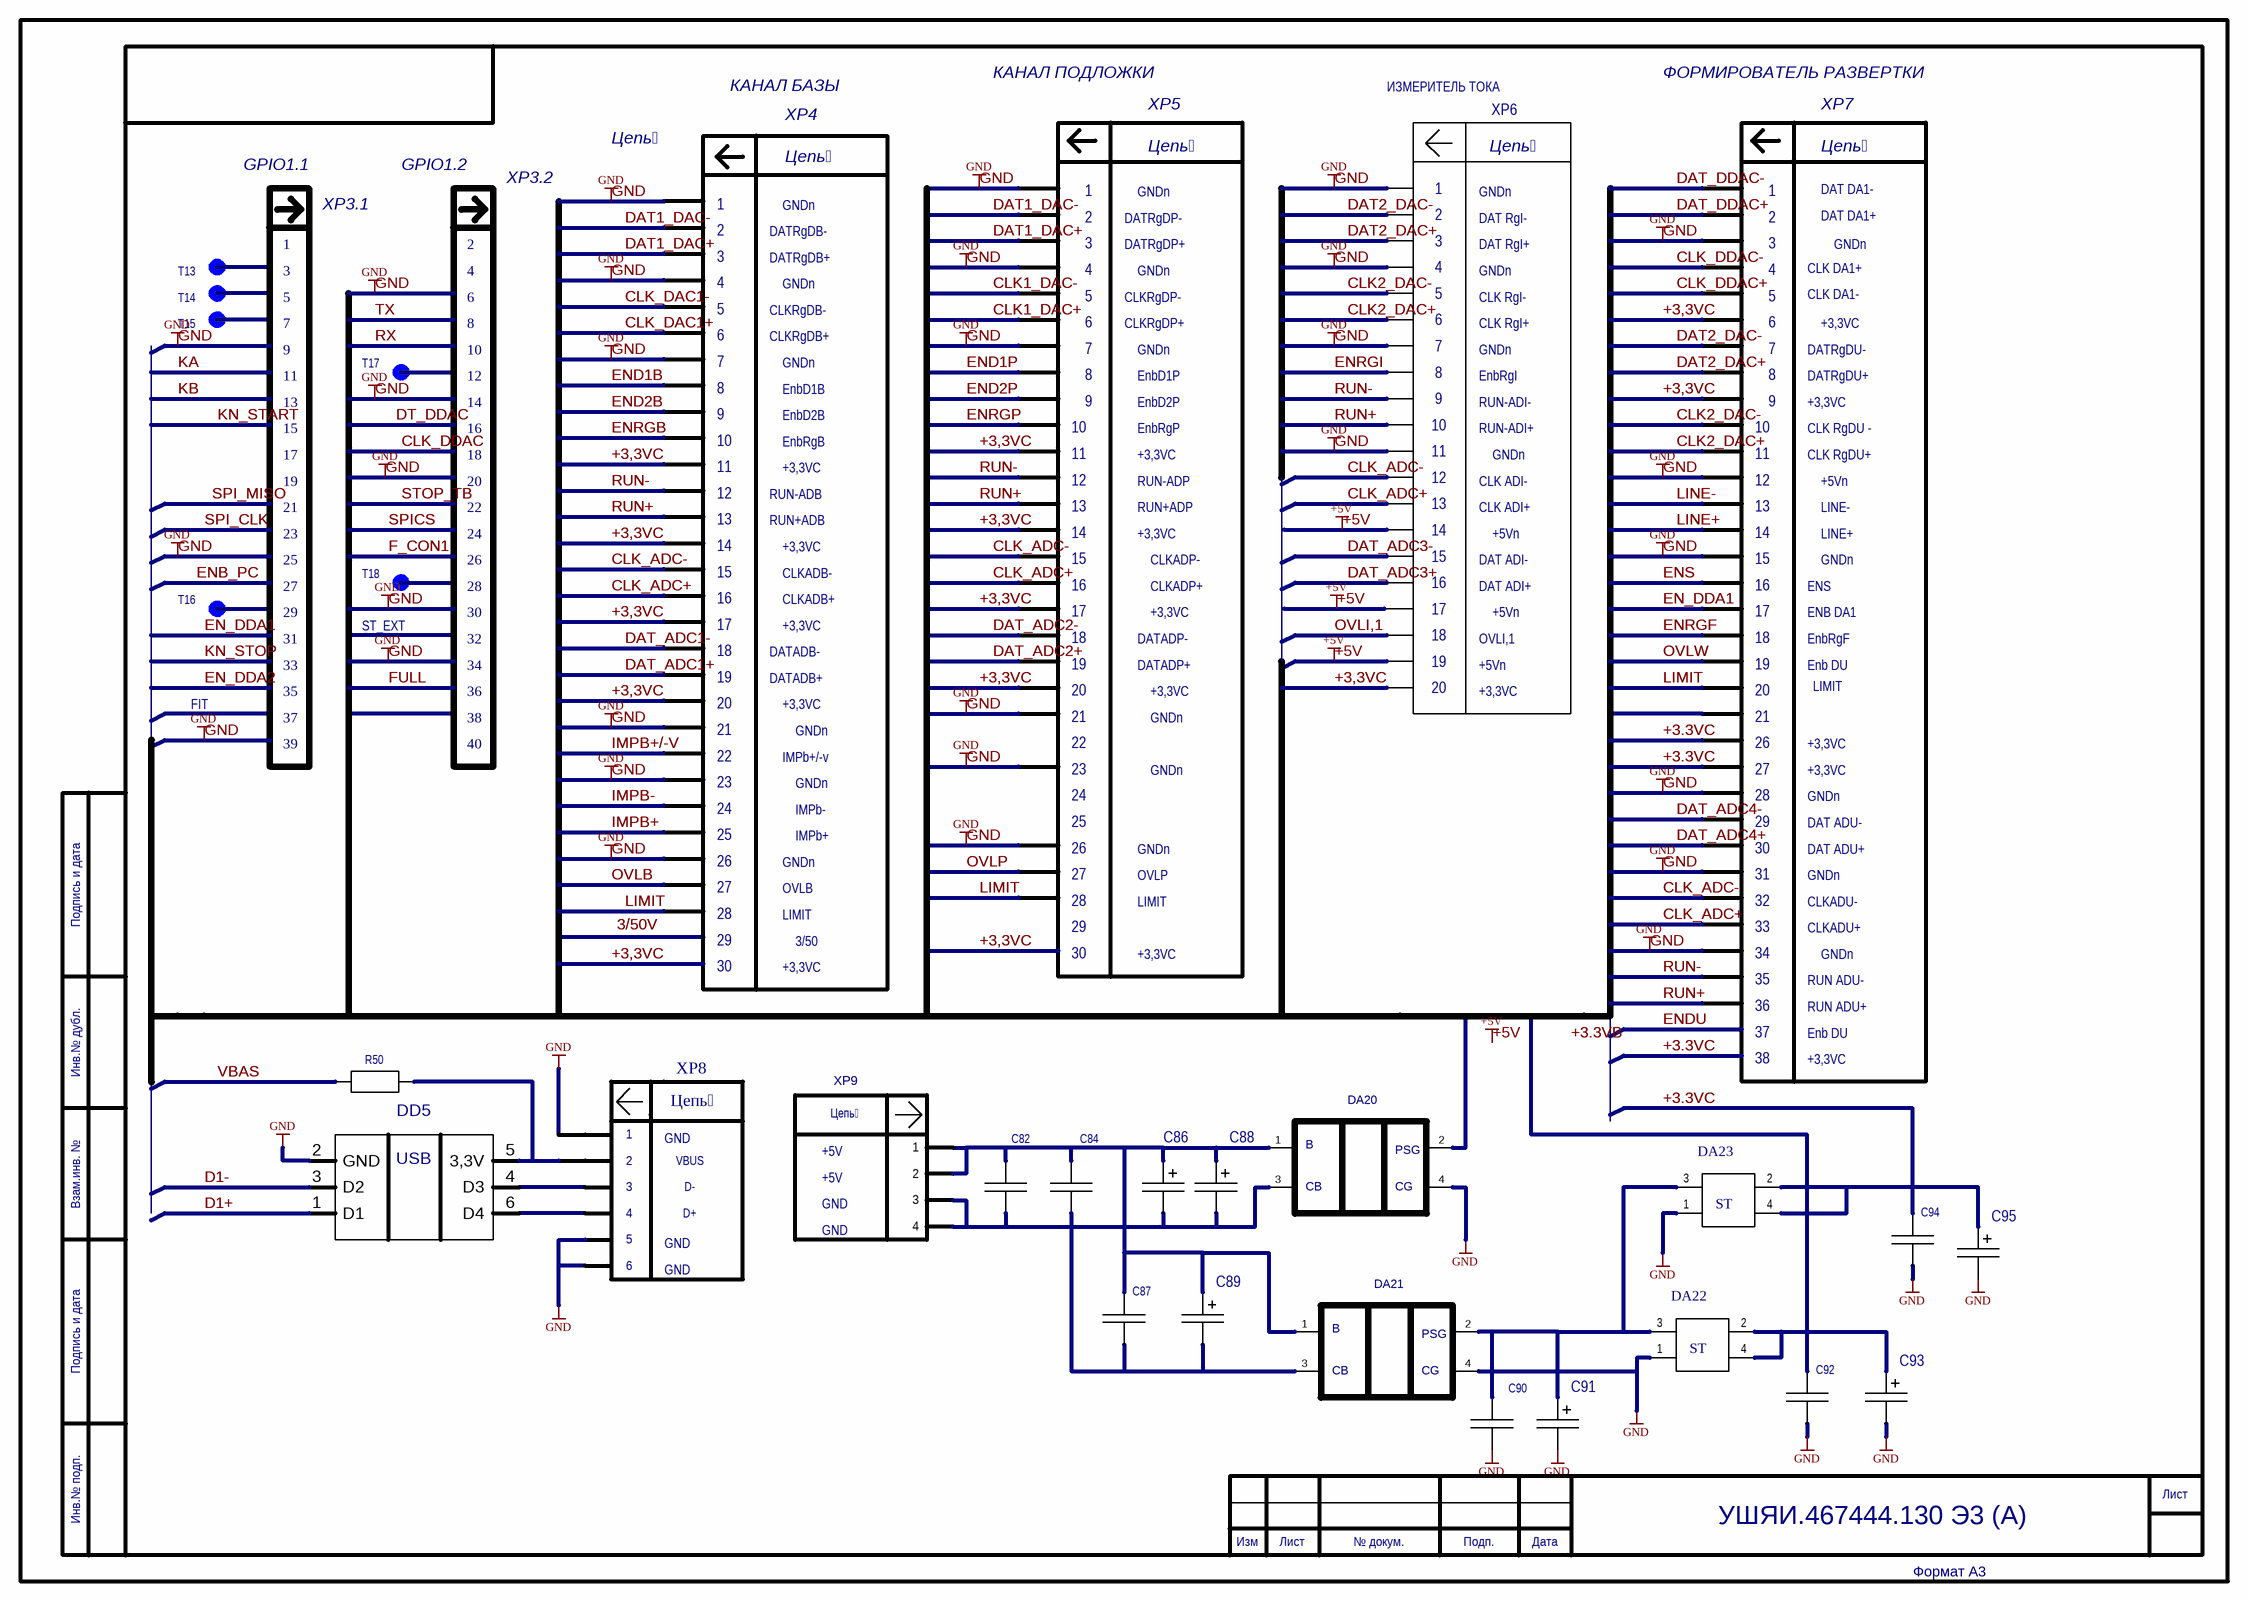
[diagram p4: Sheet4.SCHDOC]

### Parts
C82  GRM21BR71H104KA01L  (value not drawn)
C84  GRM21BR71H104KA01L  (value not drawn)
C86  TAJB106M016  (value not drawn)
C87  GRM21BR71H104KA01L  (value not drawn)
C88  TAJB106M016  (value not drawn)
C89  TAJB106M016  (value not drawn)
C90  GRM21BR71H104KA01L  (value not drawn)
C91  TAJB106M016  (value not drawn)
C92  GRM21BR71H104KA01L  (value not drawn)
C93  TAJB106M016  (value not drawn)
C94  GRM21BR71H104KA01L  (value not drawn)
C95  TAJB106M016  (value not drawn)
DA20  BNX028  (value not drawn)
DA21  BNX028  (value not drawn)
DA22  LD1117AS33TR  (value not drawn)
DA23  LD1117AS33TR  (value not drawn)
DD5  USBUF01W6  (value not drawn)
R50  0603-30 ОМ+-5%  [0603]  (value not drawn)
T40  ТОЧКА ПАЙКИ 1  [LEPESTOK7_750_224]  (value not drawn)
T41  ТОЧКА ПАЙКИ 1  [LEPESTOK7_750_224]  (value not drawn)
T46  ТОЧКА ПАЙКИ 1  [LEPESTOK7_750_224]  (value not drawn)
T47  ТОЧКА ПАЙКИ 1  [LEPESTOK7_750_224]  (value not drawn)
T59  ТОЧКА ПАЙКИ 1  [LEPESTOK7_750_224]  (value not drawn)
T65  ТОЧКА ПАЙКИ 1  [LEPESTOK7_750_224]  (value not drawn)
XP6  BH-20-A  (value not drawn)
XP8  AMP II 280372-2  (value not drawn)
XP9  AMP 0-0280371-1  (value not drawn)

### Nets
+5V: XP6.14 XP6.19
GND: C90.2 C91.2 C92.2 C93.2 C94.2 C95.2 DA20.4 DA21.4 DA22.1 DA23.1 DD5.2(GND) XP6.1 XP6.4 XP6.7 XP6.11 XP8.5 XP8.6
+3,3VC: XP6.20
+3.3VC: C94.1 C95.1 DA23.2 DA23.4
CLK2_DAC+: XP6.6
CLK2_DAC-: XP6.5
CLK_ADC+: XP6.13
CLK_ADC-: XP6.12
D1+: DD5.1(D1)
D1-: DD5.3(D2)
DAT2_DAC+: XP6.3
DAT2_DAC-: XP6.2
DAT_ADC3+: XP6.16
DAT_ADC3-: XP6.15
ENRGI: XP6.8
OVLI,1: XP6.18
RUN+: XP6.10
RUN-: XP6.9
VBAS: R50.1
NetC82_1: C82.1 C84.1 C86.1 C87.1 C88.1 C89.1 DA20.1 DA21.1 XP9.1 XP9.2
NetC82_2: C82.2 C84.2 C86.2 C87.2 C88.2 C89.2 DA20.3 DA21.3 XP9.3 XP9.4
NetC90_1: C90.1 C91.1 DA21.2 DA22.3 DA23.3
NetC92_1: C92.1 C93.1 DA22.2 DA22.4
NetDD5_4: DD5.4(D3) XP8.3
NetDD5_5: DD5.5(3,3V) R50.2
NetDD5_6: DD5.6(D4) XP8.4

Not connected (* = marked no-connect by the designer): DA20 2; T40 1; T41 1; T46 1; T47 1; T59 1; T65 1; XP6 17; XP8 1 2

### Notes on the sheet
- КАНАЛ БАЗЫ
- КАНАЛ ПОДЛОЖКИ
- XP5
- ИЗМЕРИТЕЛЬ ТОКА
- ФОРМИРОВАТЕЛЬ РАЗВЕРТКИ
- XP7
- GPIO1.1
- GPIO1.2
- XP3.2
- Цепь
- XP4
- 1
- XP3.1
- 2
- DATRgDB-
- GNDn
- 3
- DATRgDP-
- DATRgDP+
- DAT RgI-
- DAT RgI+
- DAT DA1+
- DAT DA1-
- T14
- T13
- 5
- 6
- 4
- DATRgDB+
- CLKRgDB-
- CLKRgDP-
- CLK RgI-
- CLK DA1-
- CLK DA1+
- T15
- 11
- 9
- 7
- (near T59) T17
- 8
- (near T59) 12
- 10
- CLKRgDB+
- CLKRgDP+
- EnbD1P
- EnbRgI
- CLK RgI+
- DATRgDU+
- DATRgDU-
- +3,3VC
- 15
- 13
- 16
- 14
- EnbD2B
- EnbRgB
- EnbD1B
- EnbD2P
- EnbRgP
- RUN-ADI-
- RUN-ADI+
- CLK RgDU -
- 17
- 21
- 19
- 18
- 22
- 20
- 12
- RUN-ADB
- RUN-ADP
- RUN+ADP
- CLK ADI-
- CLK ADI+
- CLK RgDU+
- +5Vn
- LINE-
- 23
- 25
- (near T47) T18
- 24
- 26
- RUN+ADB
- CLKADB-
- CLKADP-
- DAT ADI-
- LINE+
- (near T65) T16
- (near T65) 29
- 31
- 27
- (near T47) ST_EXT
- 30
- 32
- (near T47) 28
- CLKADB+
- DATADP-
- CLKADP+
- OVLI,1
- DAT ADI+
- ENB DA1
- ENS
- EnbRgF
- FIT
- 33
- 35
- 34
- 36
- DATADB-
- DATADB+
- DATADP+
- Enb DU
- LIMIT
- 39
- 37
- 40
- 38
- IMPb+/-v
- IMPb-
- IMPb+
- 29
- 28
- DAT ADU-
- Подпись и дата
- OVLB
- OVLP
- CLKADU-
- DAT ADU+
- 3/50
- RUN ADU-
- CLKADU+
- Инв.№ дубл.
- RUN ADU+
- Взам.инв. №
- (near XP8) GND
- VBUS
- D-
- +5V
- D+
- GND
- Инв.№ подп.
- УШЯИ.467444.130 Э3 (A)
- Лист
- Изм
- № докум.
- Подп.
- Дата
- Формат А3
- Подп. дата
- Инв. № дубл.
- Взам. инв. №
- Подп. и дата
- Инв. № подл.
- Изм.
- ALTIUM GOSTBOM2.0 KEV
- Файл:
- Копировал
- (in symbol AMP 0-0280371-1) Цепь
- (in symbol AMP II 280372-2) Цепь
- (in symbol BNX028) B; PSG; CB; CG
- (in symbol LD1117AS33TR) ST
- (in symbol USBUF01W6) USB

### Library data of the parts
C82 C84 C87 C90 C92 C94 = GRM21BR71H104KA01L: Name2: Конденсатор GRM21BR71H104KA01L; Value: *; Name1: Конденсатор GRM21BR71H104KA01L
C86 C88 C89 C91 C93 C95 = TAJB106M016: as C16 on sheet Sheet1; Value: *
DD5 = USBUF01W6: Name1: Микросхема USBUF01W6; Standart: STMicroelectronics; Value: *; Name2: Микросхема USBUF01W6
R50 = 0603-30 ОМ+-5%: Name1: Резистор 0603-30 Ом+-5%; Name2: Резистор 0603-30 Ом+-5%
T40 T41 T46 T47 T59 T65 = ТОЧКА ПАЙКИ 1: Name: Точка пайки; Value: *
XP6 = BH-20-A: Standart: Белконтмаш; Name2: Вилка BH-20; Name1: Вилка BH-20 Белконтмаш; Value: *
XP8 = AMP II 280372-2: Standart: ELFA (43-834-28); Name2: Вилка AMP II-280372-2 Tyco Electronics; Value: *; Name1: Вилка AMP II-280372-2 Tyco Electronics
XP9 = AMP 0-0280371-1: Name2: Вилка AMP 0-280371-2; Name1: Вилка AMP 0-280371-2 Tyco Electronics; Value: *
DA20 DA21 = BNX028: Value: *
DA22 DA23 = LD1117AS33TR: Value: *

## Sheet Sheet5.SCHDOC
size 840 x 594 mm; SheetNumber: 5; SheetTotal: 5; DocumentName: Sheet5.SCHDOC
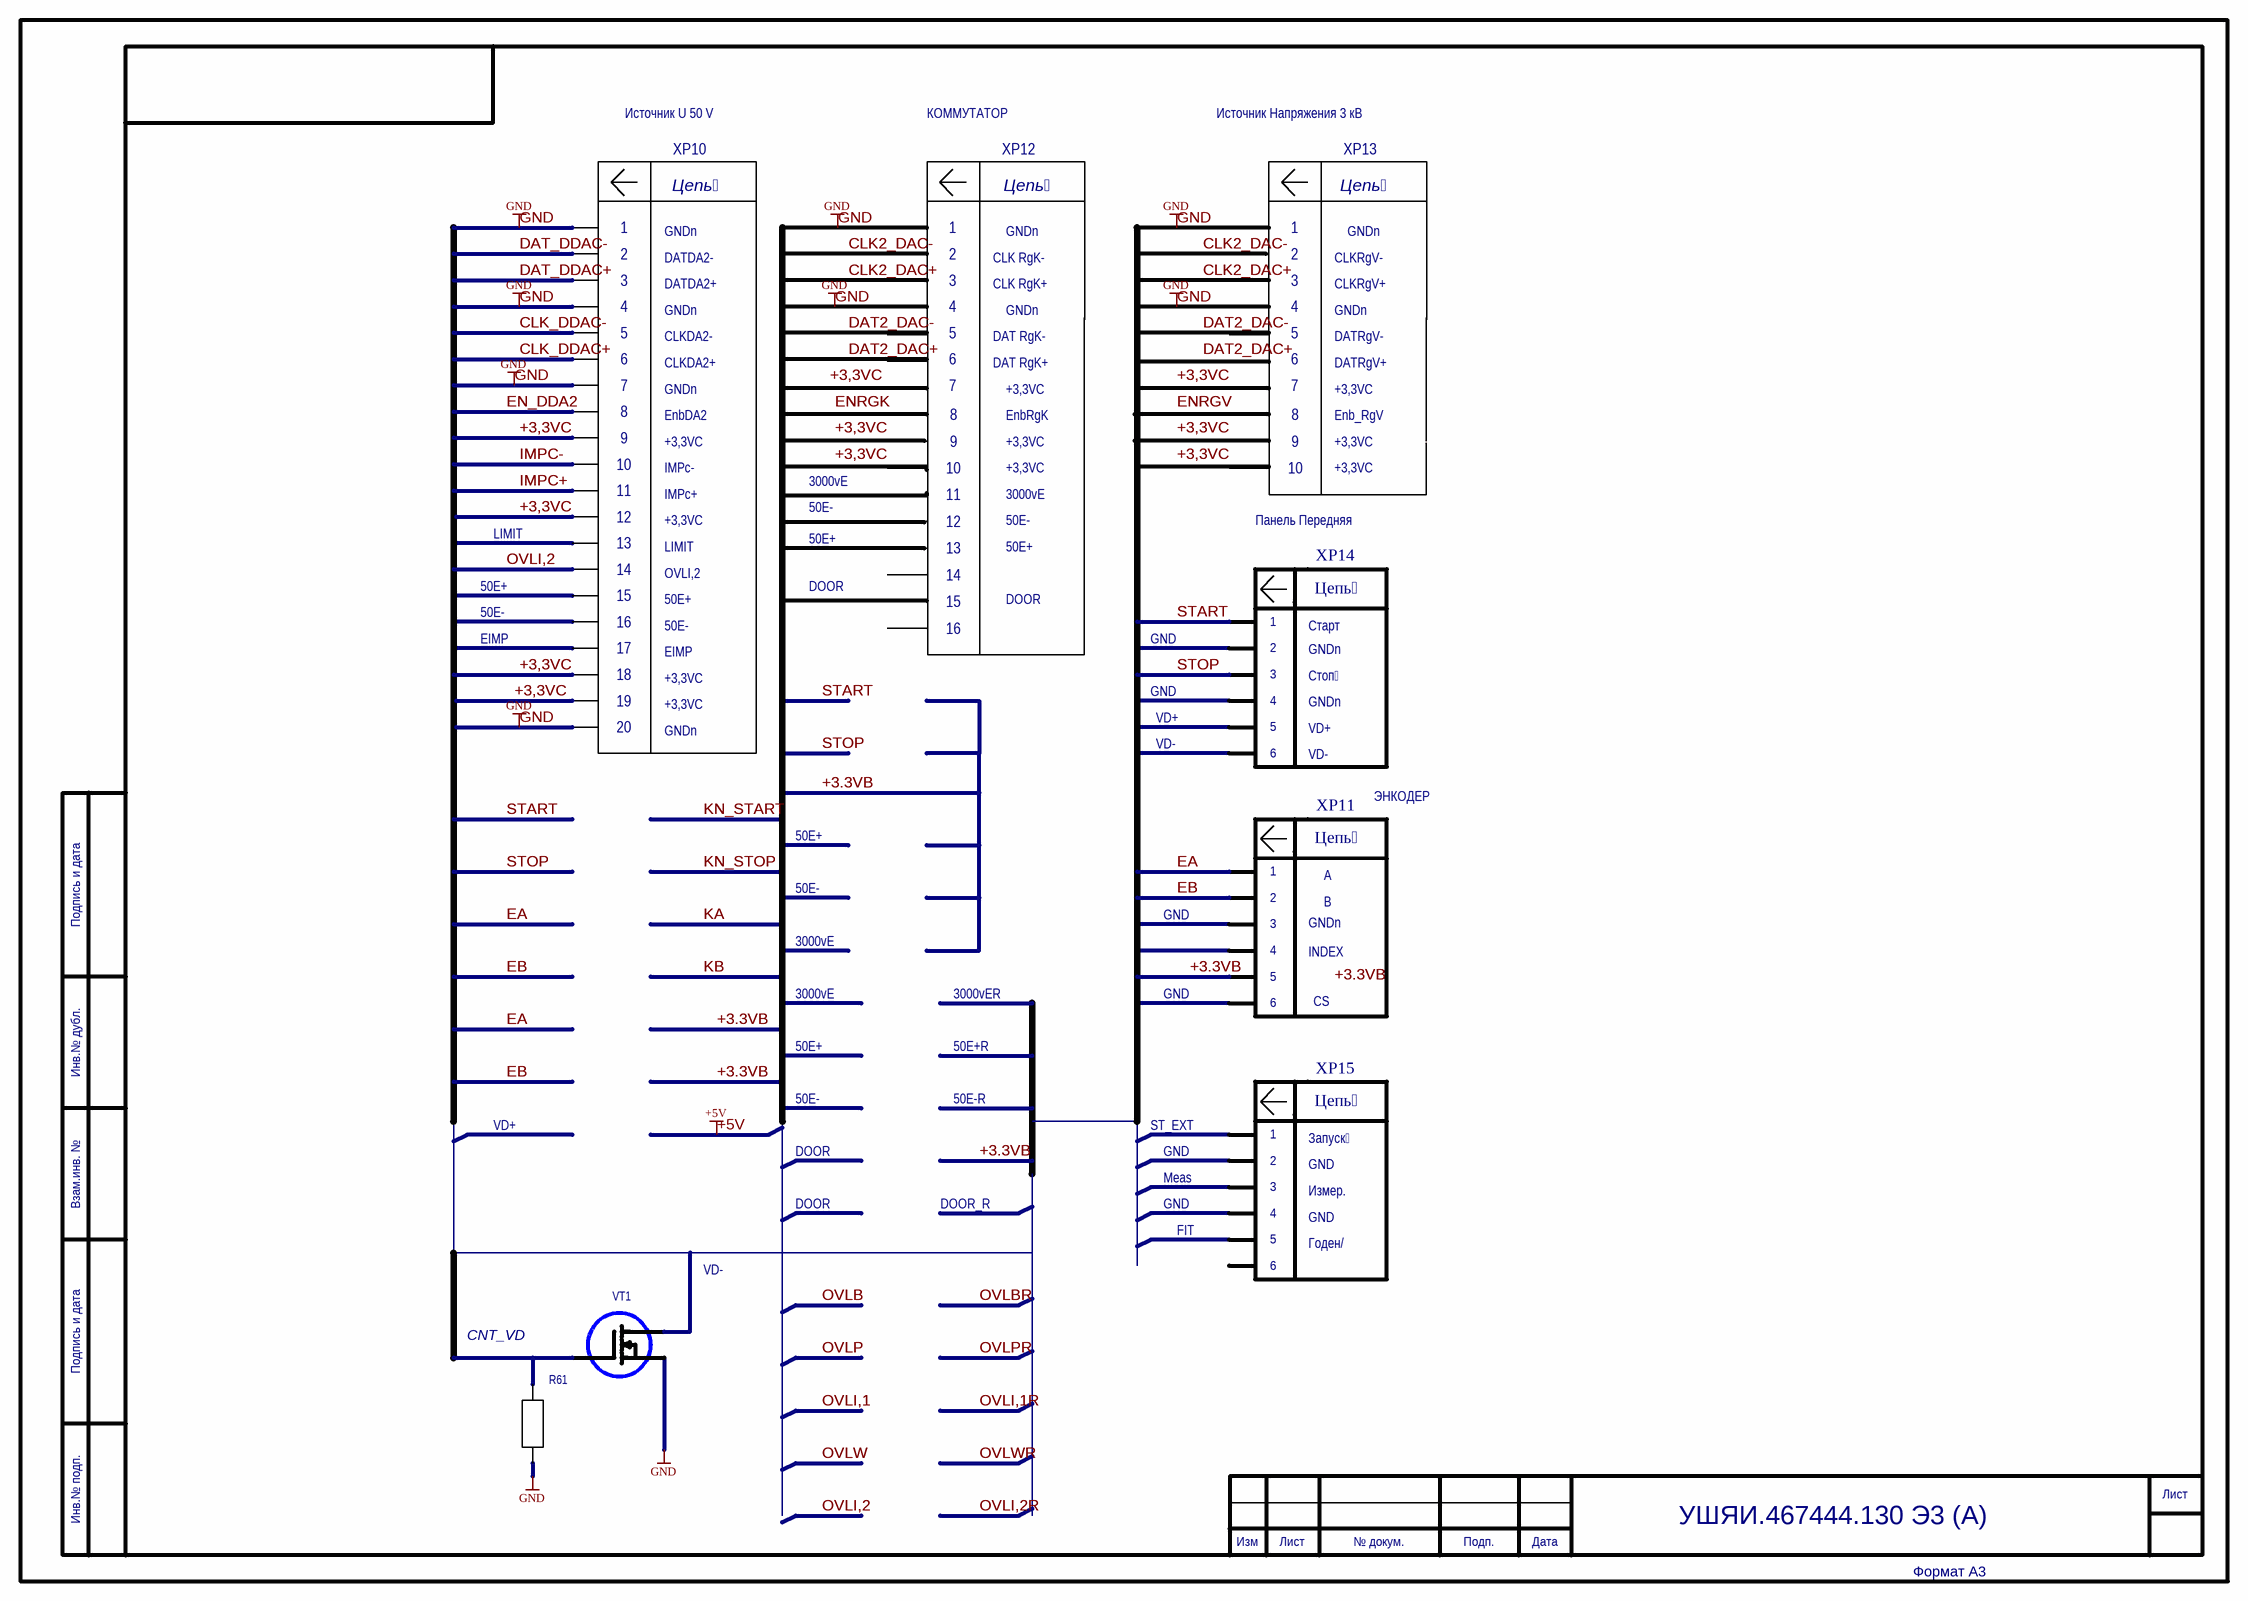
[diagram p5: Sheet5.SCHDOC]

### Parts
R61  1206-10 КОМ+-5%  (value not drawn)
VT1  NDS7002A  (value not drawn)
XP10  BH-20-A  (value not drawn)
XP11  AMP II 280372-2  (value not drawn)
XP12  BH-20-16  (value not drawn)
XP13  BH-20-10  (value not drawn)
XP14  AMP II 280372-2  (value not drawn)
XP15  AMP II 280372-2  (value not drawn)

### Nets
GND: R61.1 VT1.2 XP10.1 XP10.4 XP10.7 XP10.20
+3,3VC: XP10.9 XP10.12 XP10.18 XP10.19
+3.3VB: XP11.5
CLK_DDAC+: XP10.6
CLK_DDAC-: XP10.5
DAT_DDAC+: XP10.3
DAT_DDAC-: XP10.2
EA: XP11.1
EB: XP11.2
EN_DDA2: XP10.8
IMPC+: XP10.11
IMPC-: XP10.10
OVLI,2: XP10.14
START: XP14.1
STOP: XP14.3
NetR61_2: R61.2 VT1.1

Not connected (* = marked no-connect by the designer): VT1 3(2); XP10 13 15 16 17; XP11 3 4 6; XP12 21(0) 22(1) 23(2) 24(3) 25(4) 26(5) 27(6) 28(7) 29(0) 30(1) 31(2) 32(3) 33(4) 34(5) 35(6) 36(7); XP13 21(0) 22(1) 23(2) 24(3) 25(4) 26(5) 27(6) 28(7) 29(0) 30(1); XP14 2 4 5 6; XP15 1 2 3 4 5 6

### Notes on the sheet
- Источник U 50 V
- КОММУТАТОР
- Источник Напряжения 3 кВ
- GNDn
- Цепь
- DATDA2+
- DATDA2-
- CLK RgK+
- CLK RgK-
- CLKRgV+
- CLKRgV-
- CLKDA2+
- CLKDA2-
- DAT RgK+
- DAT RgK-
- DATRgV+
- DATRgV-
- EnbDA2
- EnbRgK
- +3,3VC
- Enb_RgV
- IMPc-
- IMPc+
- 3000vE
- LIMIT
- OVLI,2
- 50E+
- 50E-
- (near XP13) Панель Передняя
- EIMP
- DOOR
- GND
- (near XP14) Старт
- (near XP14) Стоп
- (near XP14) GNDn
- VD+
- VD-
- (near XP14) VD-
- (near XP14) VD+
- ЭНКОДЕР
- Подпись и дата
- A
- B
- (near XP11) GNDn
- (near XP11) INDEX
- Инв.№ дубл.
- 3000vER
- CS
- 50E+R
- 50E-R
- Взам.инв. №
- ST_EXT
- (near XP15) GND
- (near XP15) Запуск
- DOOR_R
- Meas
- FIT
- (near XP15) Измер.
- (near XP15) Годен/
- CNT_VD
- Инв.№ подп.
- УШЯИ.467444.130 Э3 (A)
- Лист
- Изм
- № докум.
- Подп.
- Дата
- Формат А3
- Подп. дата
- Инв. № дубл.
- Взам. инв. №
- Подп. и дата
- Инв. № подл.
- Изм.
- ALTIUM GOSTBOM2.0 KEV
- Файл:
- Копировал
- (in symbol AMP II 280372-2) Цепь
- (in symbol BH-20-10) 8; 9; 10
- (in symbol BH-20-16) 8; 9; 10; 11; 12; 13; 14; 15; 16

### Library data of the parts
R61 = 1206-10 КОМ+-5%: Name1: Резистор 1206-10 кОм+-5%; Value: *; Name2: Резистор 1206-10 кОм+-5%
VT1 = NDS7002A: Name2: Транзистор NDS7002A; Standart: FAIRCHILD Semiconductor; Value: *; Name1: Транзистор NDS7002A
XP10 = BH-20-A: as XP6 on sheet Sheet4; Value: *
XP11 XP14 XP15 = AMP II 280372-2: as XP8 on sheet Sheet4; Value: *; Name1: Вилка AMP II-280372-2 Tyco Electronics
XP12 = BH-20-16: Name2: Вилка BH-20-8; Name1: Вилка BH-20 Белконтмаш; Standart: Белконтмаш; Value: *
XP13 = BH-20-10: Name2: Вилка BH-20-8; Name1: Вилка BH-20 Белконтмаш; Standart: Белконтмаш; Value: *

## Nets that join several sheets
+5V: Sheet1 (6 pins), Sheet2 (17 pins), Sheet3 (12 pins), Sheet4 (XP6.14 XP6.19)
GND: Sheet1 (69 pins), Sheet2 (47 pins), Sheet3 (30 pins), Sheet4 (17 pins), Sheet5 (6 pins)
+3,3VC: Sheet4 (XP6.20), Sheet5 (XP10.9 XP10.12 XP10.18 XP10.19)
+3.3VB: Sheet3 (6 pins), Sheet5 (XP11.5)
CLK2_DAC+: Sheet2 (DA9.6 R23.1), Sheet4 (XP6.6)